# EAGLE design pcbv1schematic (EAGLE 9.6.2)
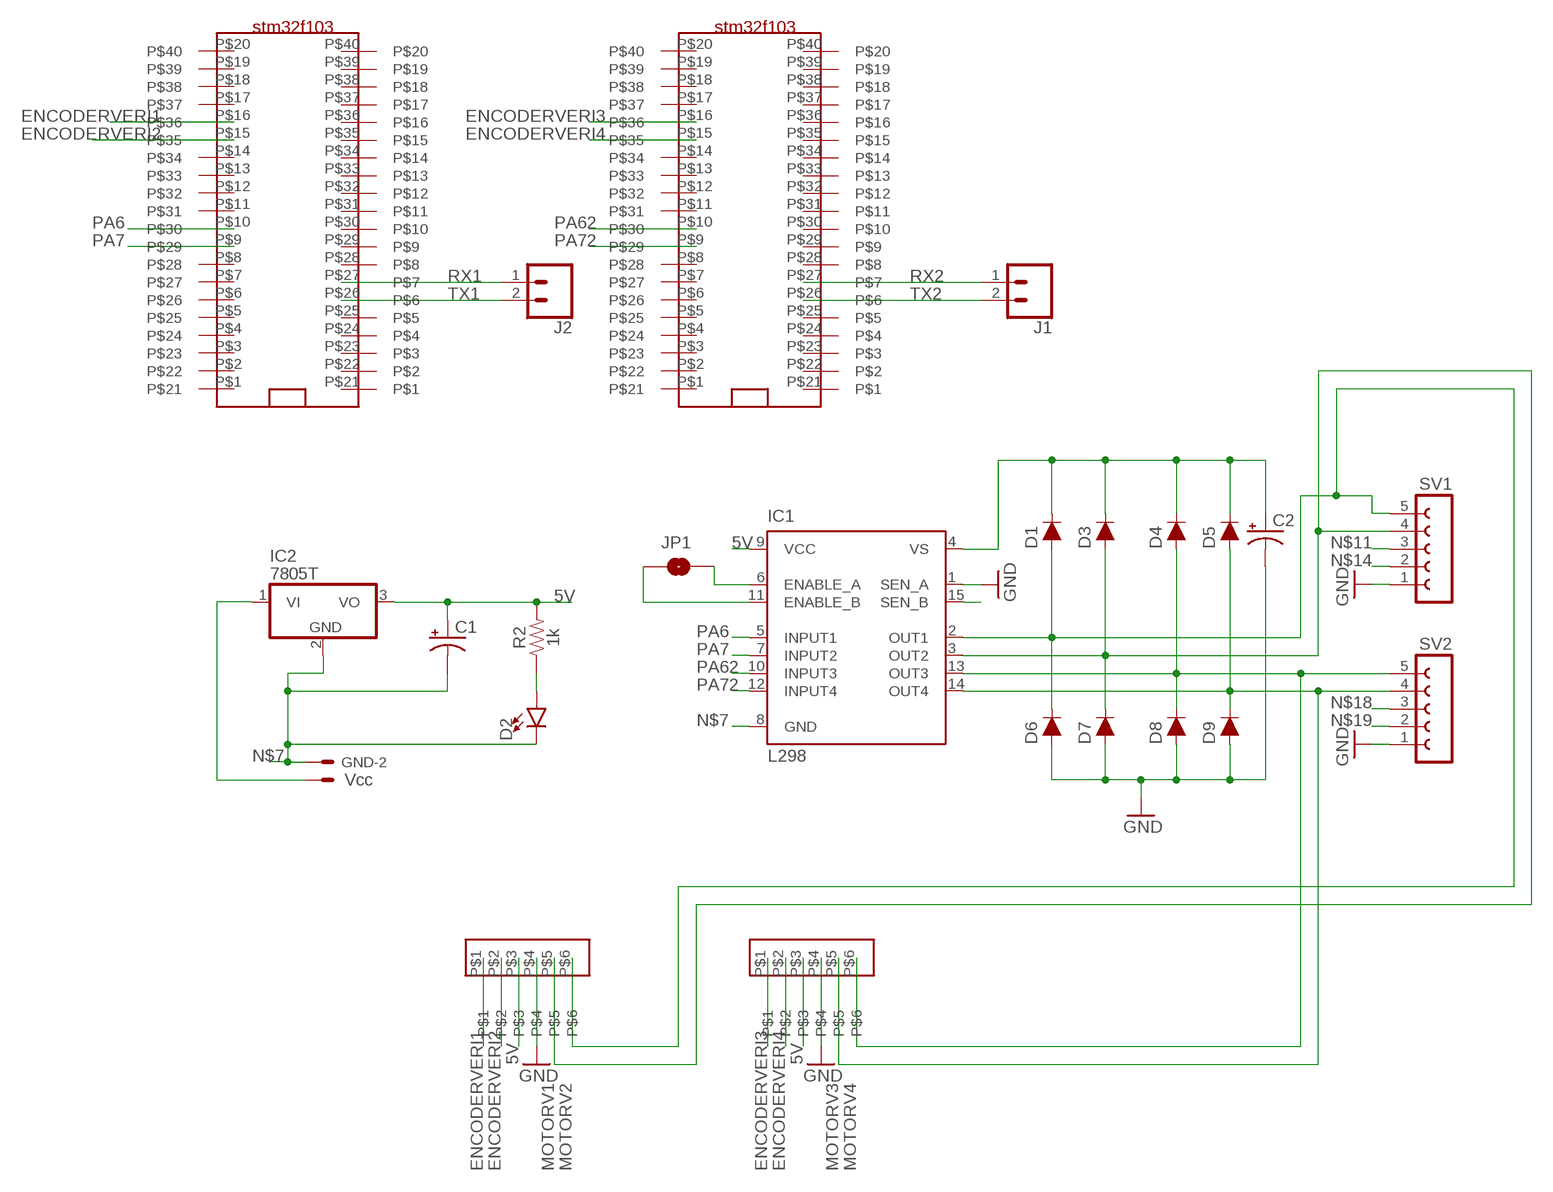
[diagram p0: schematic, sheet 1]

## Parts
C1  1mf  1000UF-RADIAL-5MM-35V-20%-KIT  [CPOL-RADIAL-5MM-10MM-KIT]
C2  1mf  1000UF-RADIAL-5MM-35V-20%-KIT  [CPOL-RADIAL-5MM-10MM-KIT]
D1  200mA/100V/1V  DIODE-1N4148  [DIODE-1N4148]
D2  LED0603  [LED-0603]
D3  200mA/100V/1V  DIODE-1N4148  [DIODE-1N4148]
D4  200mA/100V/1V  DIODE-1N4148  [DIODE-1N4148]
D5  200mA/100V/1V  DIODE-1N4148  [DIODE-1N4148]
D6  200mA/100V/1V  DIODE-1N4148  [DIODE-1N4148]
D7  200mA/100V/1V  DIODE-1N4148  [DIODE-1N4148]
D8  200mA/100V/1V  DIODE-1N4148  [DIODE-1N4148]
D9  200mA/100V/1V  DIODE-1N4148  [DIODE-1N4148]
GND  Vcc  22-23-2021  [22-23-2021]
IC1  L298  [MULTIWATT-15]
IC2  7805T  [TO220H]
J1  CONN_02  [1X02]
J2  CONN_02  [1X02]
JP1  JUMPER-SMT_2_NO_NO-SILK  [SMT-JUMPER_2_NO_NO-SILK]
R2  1k  1KOHM-0603-1/10W-1%  [0603]
SV1  FE05-1  [FE05-1]
SV2  FE05-1  [FE05-1]
U$1  STM32F103  [STM32F103]
U$2  STM32F103  [STM32F103]
U$3  KLAMENS6  [KLAMENS6]
U$4  KLAMENS6  [KLAMENS6]

## Nets
5V: C1.+ IC1.9(VCC) IC2.3(VO) R2.2 U$3.P$3 U$4.P$3
ENCODERVERI1: U$2.P$16 U$3.P$1
ENCODERVERI2: U$2.P$15 U$3.P$2
ENCODERVERI3: U$1.P$16 U$4.P$1
ENCODERVERI4: U$1.P$15 U$4.P$2
MOTORV1: D3.A D7.C IC1.3(OUT2) SV1.4 U$3.P$5
MOTORV2: D1.A D6.C IC1.2(OUT1) SV1.5 U$3.P$6
MOTORV3: D5.A D9.C IC1.14(OUT4) SV2.4 U$4.P$5
MOTORV4: D4.A D8.C IC1.13(OUT3) SV2.5 U$4.P$6
N$1: GND.2 IC2.1(VI)
N$3: IC1.11(ENABLE_B) JP1.1
N$4: D2.A R2.1
N$6: IC1.15(SEN_B)
N$7: C1.- C2.- D2.C D6.A D7.A D8.A D9.A GND.1 IC1.1(SEN_A) IC1.8(GND) IC2.2(GND) SV1.1 SV2.1 U$3.P$4 U$4.P$4 ; supply symbol labelled GND
N$11: SV1.3
N$12: IC1.6(ENABLE_A) JP1.2
N$14: SV1.2
N$18: SV2.3
N$19: SV2.2
OUT1: C2.+ D1.C D3.C D4.C D5.C IC1.4(VS)
PA6: IC1.5(INPUT1) U$2.P$10
PA7: IC1.7(INPUT2) U$2.P$9
PA62: IC1.10(INPUT3) U$1.P$10
PA72: IC1.12(INPUT4) U$1.P$9
RX1: J2.1 U$2.P$27
RX2: J1.1 U$1.P$27
TX1: J2.2 U$2.P$26
TX2: J1.2 U$1.P$26
Unconnected: U$1.P$1 U$1.P$2 U$1.P$3 U$1.P$4 U$1.P$5 U$1.P$6 U$1.P$7 U$1.P$8 U$1.P$11 U$1.P$12 U$1.P$13 U$1.P$14 U$1.P$17 U$1.P$18 U$1.P$19 U$1.P$20 U$1.P$21 U$1.P$22 U$1.P$23 U$1.P$24 U$1.P$25 U$1.P$28 U$1.P$29 U$1.P$30 U$1.P$31 U$1.P$32 U$1.P$33 U$1.P$34 U$1.P$35 U$1.P$36 U$1.P$37 U$1.P$38 U$1.P$39 U$1.P$40 U$2.P$1 U$2.P$2 U$2.P$3 U$2.P$4 U$2.P$5 U$2.P$6 U$2.P$7 U$2.P$8 U$2.P$11 U$2.P$12 U$2.P$13 U$2.P$14 U$2.P$17 U$2.P$18 U$2.P$19 U$2.P$20 U$2.P$21 U$2.P$22 U$2.P$23 U$2.P$24 U$2.P$25 U$2.P$28 U$2.P$29 U$2.P$30 U$2.P$31 U$2.P$32 U$2.P$33 U$2.P$34 U$2.P$35 U$2.P$36 U$2.P$37 U$2.P$38 U$2.P$39 U$2.P$40

## Library data of the parts
C1 C2 = SparkFun-Capacitors:1000UF: 1,000µF/1mF ceramic capacitors A capacitor is a passive two-terminal electrical component used to store electrical energy temporarily in an electric field. CAP-08070; PROD_ID: CAP-09538
D1 D3-D9 = SparkFun-DiscreteSemi:DIODE: Diode These are standard reverse protection diodes and small signal diodes. SparkFun Products: SparkFun SparkPunk Sound Kit <https://www.sparkfun.com/products/11177> SparkFun ESP8266 Thing <https://www.sparkfun.com/products/13231>; PROD_ID: DIO-08378
D2 = SparkFun-LED:LED: LED (Generic) Standard schematic elements and footprints for 5mm, 3mm, 1206, and 0603 sized LEDs. Generic LEDs with no color specified.
GND = con-molex:22-23-2021: .100" (2.54mm) Center Header - 2 Pin; MF: MOLEX; MPN: 22-23-2021; OC_FARNELL: 1462926; OC_NEWARK: 25C3832
IC1 = st-microelectronics:L298: DUAL FULL-BRIDGE DRIVER; MPN: L298N; OC_FARNELL: 1589425; OC_NEWARK: 32M1527
IC2 = linear:78*: Positive VOLTAGE REGULATOR Source: http://cache.national.com/ds/LM/LM78L05.pdf http://www.fairchildsemi.com/ds/LM/LM7805.pdf
J1 J2 = SparkFun-Connectors:CONN_02: Multi connection point. Often used as Generic Header-pin footprint for 0.1 inch spaced/style header connections On any of the 0.1 inch spaced packages, you can populate with these: Break Away Headers - Straight <https://www.sparkfun.com/products/116> (PRT-00116) Break Away Male Headers - Right Angle <https://www.sparkfun.com/products/553> (PRT-00553) Female Headers <https://www.sparkfun.com/products/115> (PRT-00115) Break Away Headers - Machine Pin <https://www.sparkfun.com/products/117> (PRT-00117) Break Away Female Headers - Swiss Machine Pin <https://www.sparkfun.com/products/743> (PRT-00743) For SCREWTERMINALS and SPRING TERMINALS visit here: Screw Terimnals on SparkFun.com <https://www.sparkfun.com/search/results?term=Screw+Terminals> (5mm/3.5mm/2.54mm spacing) This device is also useful as a general connection point to wire up your design to another part of your project. Our various solder wires solder well into these plated through hole pads. Hook-Up Wire - Assortment (Stranded, 22 AWG) <https://www.sparkfun.com/products/11375> (PRT-11375) Hook-Up Wire - Assortment (Solid Core, 22 AWG) <https://www.sparkfun.com/products/11367> (PRT-11367) View the entire wire category on our website here <https://www.sparkfun.com/categories/141> Special notes: Molex polarized connector foot print use with: PRT-08233 with associated crimp pins and housings. 2.54_SCREWTERM for use with PRT-10571. 3.5mm Screw Terminal footprints for PRT-08084 5mm Screw Terminal footprints for use with PRT-08432
JP1 = SparkFun-Jumpers:JUMPER-SMT_2_NO: Normally open jumper This jumper has two pads in close proximity to each other. Apply solder to close the connection. Round pads are easier to solder for beginners, but are a lot larger. SparkFun Product that uses the round pads: SparkFun EL Sequencer <https://www.sparkfun.com/products/12781>
R2 = SparkFun-Resistors:1KOHM: 1kΩ resistor A resistor is a passive two-terminal electrical component that implements electrical resistance as a circuit element. Resistors act to reduce current flow, and, at the same time, act to lower voltage levels within circuits. - Wikipedia; PROD_ID: RES-07856
SV1 SV2 = con-lsta:FE05-1: FEMALE HEADER; OC_FARNELL: unknown; OC_NEWARK: unknown
U$1 U$2 = pcbv1:STM32F103
U$3 U$4 = klamens6x:KLAMENS6

## Board
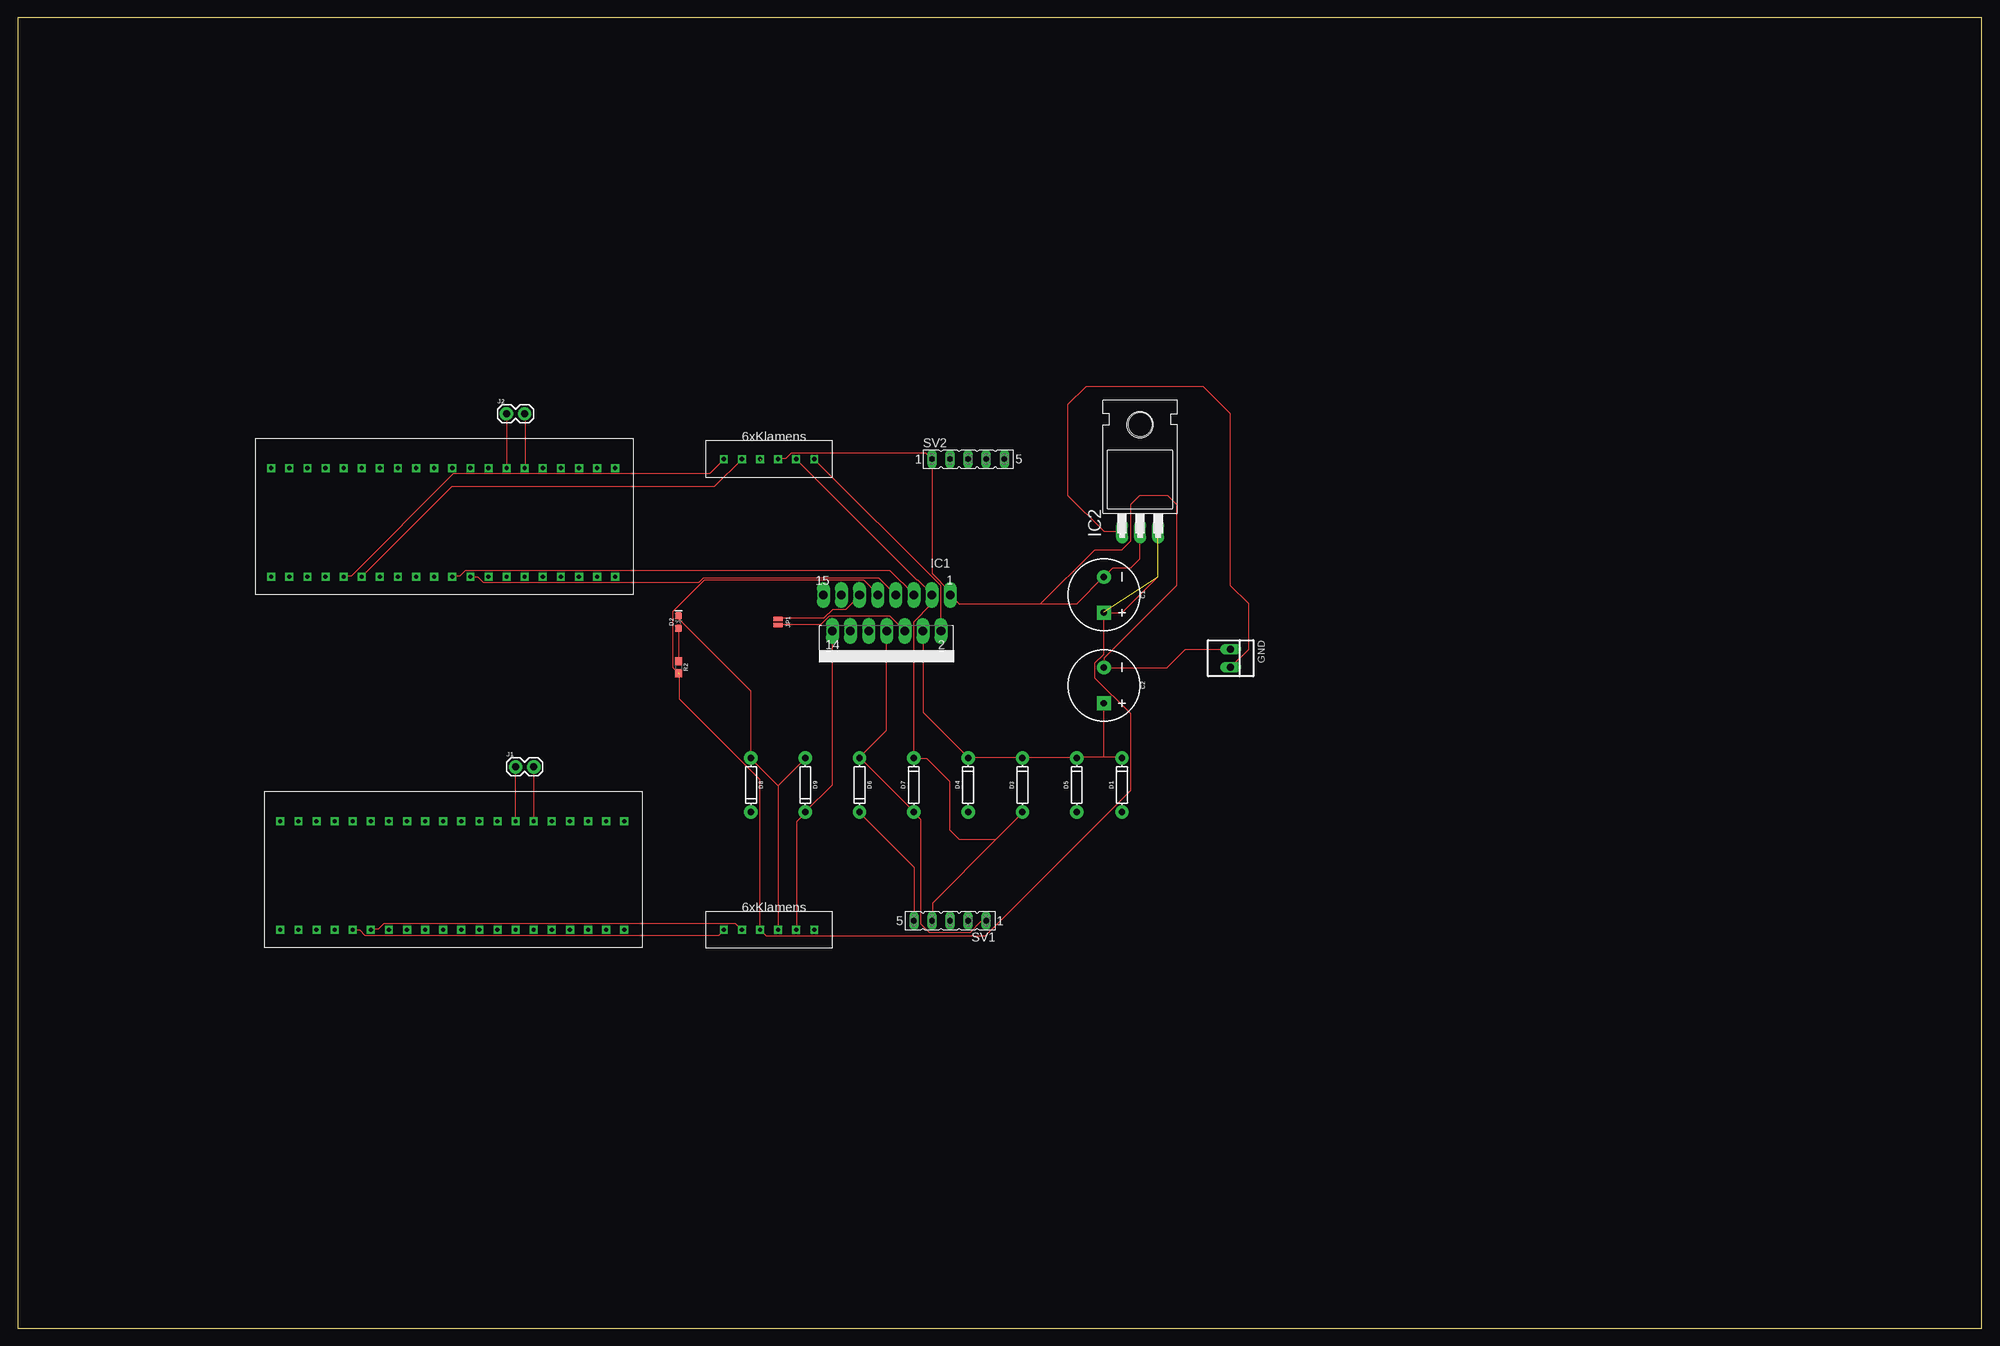
[diagram p1: board, top side]
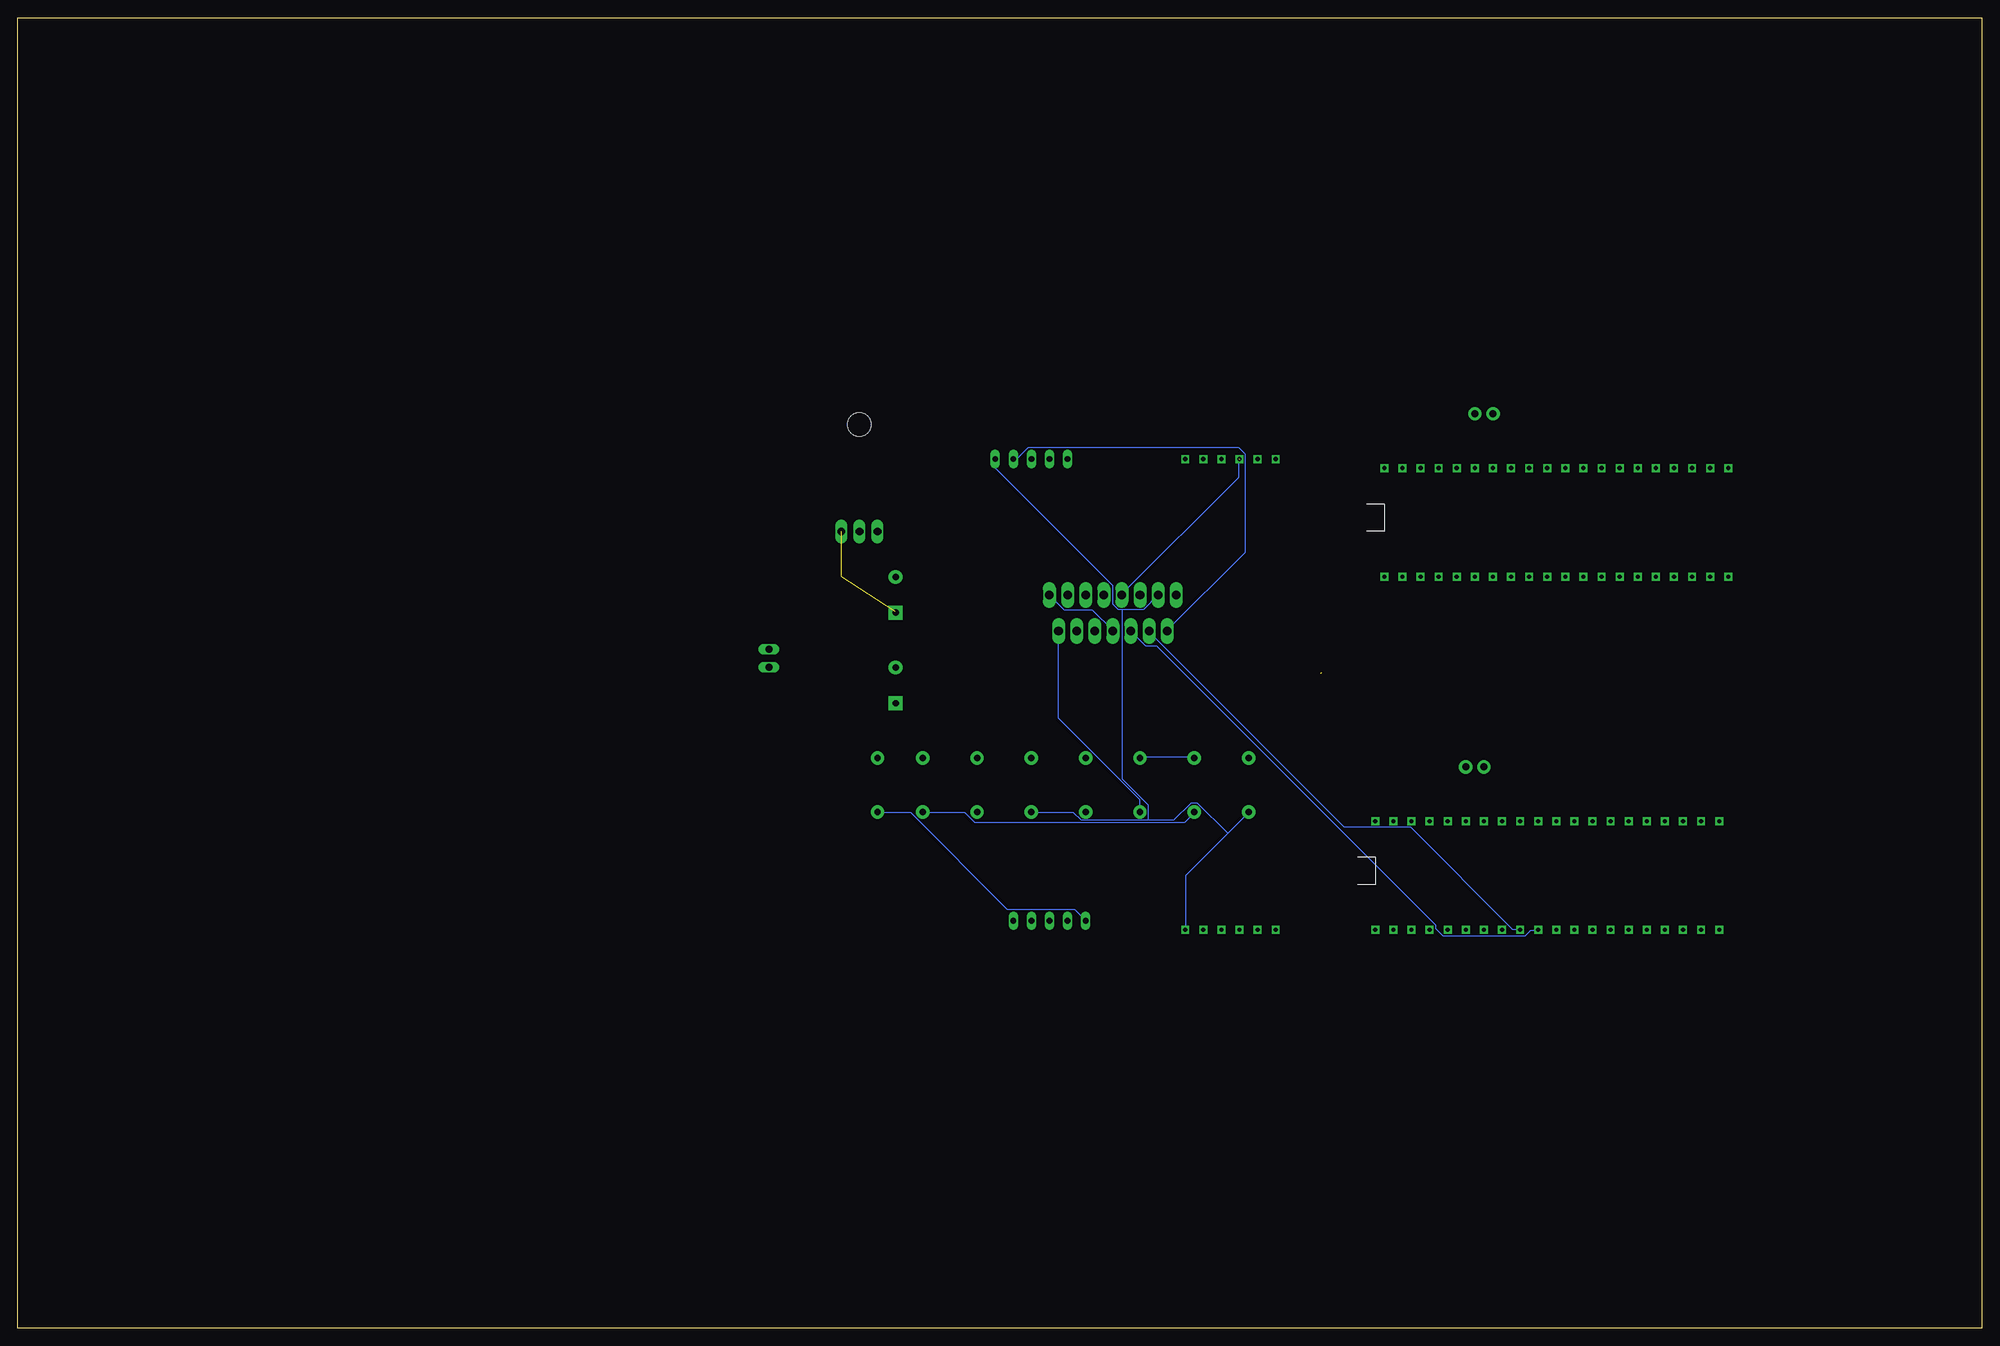
[diagram p2: board, bottom side, seen from below]

Size 275.57 x 183.82 mm. Coordinates in mm from the lower left corner, seen from the top.
Outline: 0,0 275.57,0 275.57,183.82 0,183.82 0,0
Copper layers (1*16): Top 0.035mm / dielectric 1.5mm / Bottom 0.035mm
Design rules "default": minimum track width 6mil, minimum drill 0.35mm, track to track 6mil, track to pad 6mil, pad to pad 6mil, via to via 6mil, smd to smd 6mil, copper to edge 40mil, drill to drill 6mil, minimum pad ring 10mil, minimum via ring 8mil, stop-mask expansion 4mil, vias tented up to drill 0mil, thermal gap 10mil

### Footprints (pad centres in the part's own frame; a part is rotated, then mirrored left to right if it is on the bottom)
CPOL-RADIAL-5MM-10MM-KIT = drill 0.9 pad 1.93 square: + 2.5,0 | drill 0.9 pad 1.93: - -2.5,0
DIODE-1N4148 = drill 0.9 pad 1.88: A -3.81,0; C 3.81,0
LED-0603 = smd 1 x 1: A -0.877,0; C 0.877,0
22-23-2021 = drill 1 long: 1 -1.27,0; 2 1.27,0
MULTIWATT-15 = drill 1.2 long: 1 -8.89,-7.62; 2 -7.62,-2.54; 3 -6.35,-7.62; 4 -5.08,-2.54; 5 -3.81,-7.62; 6 -2.54,-2.54; 7 -1.27,-7.62; 8 0,-2.54; 9 1.27,-7.62; 10 2.54,-2.54; 11 3.81,-7.62; 12 5.08,-2.54; 13 6.35,-7.62; 14 7.62,-2.54; 15 8.89,-7.62
TO220H = drill 1.118 long: 1 -2.54,-10.16; 2 0,-10.16; 3 2.54,-10.16 | hole 3.302: 0,4.826
1X02 = drill 1.016 pad 1.88: 1 0,0; 2 2.54,0
SMT-JUMPER_2_NO_NO-SILK = smd 0.635 x 1.27: 1 -0.406,0; 2 0.406,0
0603 = smd 1.1 x 1: 1 -0.85,0; 2 0.85,0
FE05-1 = drill 0.813 long: 1 -5.08,0; 2 -2.54,0; 3 0,0; 4 2.54,0; 5 5.08,0
STM32F103 = drill 0.6 square: P$1 2.54,2.54; P$2 2.54,5.08; P$3 2.54,7.62; P$4 2.54,10.16; P$5 2.54,12.7; P$6 2.54,15.24; P$7 2.54,17.78; P$8 2.54,20.32; P$9 2.54,22.86; P$10 2.54,25.4; P$11 2.54,27.94; P$12 2.54,30.48; P$13 2.54,33.02; P$14 2.54,35.56; P$15 2.54,38.1; P$16 2.54,40.64; P$17 2.54,43.18; P$18 2.54,45.72; P$19 2.54,48.26; P$20 2.54,50.8; P$21 17.78,2.54; P$22 17.78,5.08; P$23 17.78,7.62; P$24 17.78,10.16; P$25 17.78,12.7; P$26 17.78,15.24; P$27 17.78,17.78; P$28 17.78,20.32; P$29 17.78,22.86; P$30 17.78,25.4; P$31 17.78,27.94; P$32 17.78,30.48; P$33 17.78,33.02; P$34 17.78,35.56; P$35 17.78,38.1; P$36 17.78,40.64; P$37 17.78,43.18; P$38 17.78,45.72; P$39 17.78,48.26; P$40 17.78,50.8
KLAMENS6 = drill 0.6 square: P$1 -10.16,2.54; P$2 -7.62,2.54; P$3 -5.08,2.54; P$4 -2.54,2.54; P$5 0,2.54; P$6 2.54,2.54

### Placement (x,y rotation side)
C1  152.4,102.87 270 top
C2  152.4,90.17 270 top
D1  154.94,76.2 90 top
D2  92.71,99.06 90 top
D3  140.97,76.2 90 top
D4  133.35,76.2 90 top
D5  148.59,76.2 90 top
D6  118.11,76.2 270 top
D7  125.73,76.2 90 top
D8  102.87,76.2 270 top
D9  110.49,76.2 270 top
GND  170.18,93.98 270 top
IC1  121.92,95.25 180 top
IC2  157.48,121.92 0 top
J1  69.85,78.74 0 top
J2  68.58,128.27 0 top
JP1  106.68,99.06 270 top
R2  92.71,92.71 270 top
SV1  130.81,57.15 180 top
SV2  133.35,121.92 0 top
U$1  87.63,53.34 90 top
U$2  86.36,102.87 90 top
U$3  109.22,119.38 0 top
U$4  109.22,53.34 0 top

### Tracks (layer width: path | path; a pad name or v marks a point on that pad's centre or on a via)
5V  (5 unrouted)
  Top 0.152: 92.66,91.95 91.9,92.71 91.9,100.48 96.32,104.9 118.72,104.9 120.7,102.92 IC1.9 120.7,102.77 | 160.02,105.41 154.94,100.33 152.4,100.33 152.4,94.54 151.18,93.32 151.18,91.19 156.21,86.16 156.21,75.49 135.79,55.07 105,55.07 104.24,55.83 U$4.P$3 104.09,55.98 104.09,77.01 92.81,88.29 92.81,91.8
  Bottom 0.152: 152.4,100.48 C1.+ 152.4,100.33 | 104.24,121.82 104.24,119.38 120.7,102.92 IC1.9
ENCODERVERI1
  Top 0.152: U$2.P$16 45.72,105.51 46.79,105.51 61.11,119.84 97.08,119.84 99.06,121.82 U$3.P$1
ENCODERVERI2
  Top 0.152: U$2.P$15 60.96,118.11 97.79,118.11 U$3.P$2
ENCODERVERI3
  Top 0.152: U$1.P$16 47.09,55.83 48.01,55.83 48.77,55.07 98.3,55.07 99.06,55.83 U$4.P$1
ENCODERVERI4
  Top 0.152: U$4.P$2 100.74,56.74 51.36,56.74 50.6,55.98 49.53,55.98 U$1.P$15
MOTORV1
  Top 0.152: U$3.P$5 109.27,121.82 126.19,104.9 126.34,104.9 128.32,102.92 IC1.3 128.17,102.77 128.17,101.55 125.73,99.11 D7.C 125.73,79.91 127.56,79.91 130.81,76.66 130.81,69.85 132.13,68.53 137.21,68.53 | 137.21,68.53 140.97,72.29 D3.A | 137.21,68.53 128.32,59.64 128.32,57.2 SV1.4
MOTORV2
  Top 0.152: U$3.P$6 129.54,104.14 IC1.2 | SV1.5 125.73,64.67 118.11,72.29 D6.C
  Bottom 0.152: D1.A 154.84,72.29 150.27,72.29 136.7,58.72 127.25,58.72 125.73,57.2 SV1.5 | IC1.2 129.54,85.55 118.11,74.12 D6.C
MOTORV3
  Top 0.152: U$4.P$5 109.27,55.98 109.27,71.07 110.49,72.29 D9.C 110.49,72.44 114.3,76.25 IC1.14
  Bottom 0.152: SV2.4 135.79,121.97 135.33,121.97 133.81,123.5 104.24,123.5 103.33,122.58 103.33,108.86 114.3,97.89 IC1.14 | D5.A 148.59,72.29 142.65,72.29 141.28,70.92 111.86,70.92 110.49,72.29 D9.C
MOTORV4
  Bottom 0.152: 120.55,100.79 117.65,100.79 IC1.13 | 120.55,100.79 121.16,100.79 121.92,101.55 121.92,104.14 138.38,120.6 138.38,121.82 SV2.5 | 105.77,69.39 102.87,72.29 D8.C | 105.77,69.39 111.71,63.45 111.71,55.98 U$4.P$6 | 116.89,71.22 113.39,71.22 110.95,73.66 110.03,73.66 105.77,69.39 | 116.89,71.22 126.34,71.22 127.41,72.29 133.35,72.29 D4.A | 120.55,100.79 120.55,77.01 116.89,73.35 116.89,71.22
N$1
  Top 0.152: GND.2 172.72,95.25 172.72,101.6 170.18,104.14 170.18,128.27 166.37,132.08 149.86,132.08 147.32,129.54 147.32,116.84 152.4,111.76 IC2.1
N$3
  Top 0.152: JP1.1 106.68,99.57 113.08,99.57 114.3,100.79 116.13,100.79 118.11,102.77 IC1.11
N$4
  Top 0.152: D2.A 92.81,98.04 92.81,93.62 R2.1
N$7
  Top 0.152: 143.51,101.6 151.13,109.22 154.94,109.22 156.21,110.49 156.21,115.57 157.48,116.84 161.29,116.84 162.56,115.57 162.56,104.14 152.4,93.98 C2.- 161.25,92.67 163.83,95.25 GND.1 | SV1.1 135.79,57.05 135.18,57.05 133.66,55.52 127.86,55.52 126.64,56.74 126.64,71.37 125.73,72.29 D7.A 125.73,72.44 118.11,80.06 | U$3.P$4 106.68,121.97 107.75,121.97 108.51,122.73 127.41,122.73 128.17,121.97 SV2.1 128.32,121.82 128.32,105.82 130.76,103.38 130.76,102.92 IC1.1 132.08,101.6 | D2.C 92.81,99.87 92.81,99.42 102.87,89.36 D8.A 102.87,79.91 106.68,76.1 | 106.68,76.1 U$4.P$4 | 106.68,76.1 110.49,79.91 D9.A | IC1.8 121.92,83.87 118.11,80.06 | 118.11,80.06 D6.A | 132.08,101.6 132.13,101.55 | IC2.2 157.48,107.95 156.21,106.68 153.67,106.68 152.38,105.38 | 132.08,101.6 143.51,101.6 | 143.51,101.6 143.56,101.6 | 143.56,101.6 148.59,101.6 152.38,105.38 | C1.- 152.38,105.38 | 143.56,101.6 143.56,101.55 143.51,101.6
  Bottom 0.152: 157.43,111.76 IC2.2 | 152.4,92.71 C2.- | IC1.8 121.92,97.89 124.82,100.79 128.78,100.79 130.76,102.77 IC1.1 | D6.A 118.11,80.06 110.49,80.06 D9.A
N$12
  Top 0.152: JP1.2 112.62,98.65 113.84,99.87 122.38,99.87 IC1.6
OUT1
  Top 0.152: 152.4,80.06 154.84,80.06 D1.C | 152.4,80.06 148.59,80.06 | 152.4,80.06 C2.+ | 133.35,80.06 127.1,86.31 127.1,97.74 IC1.4 | 133.35,80.06 140.97,80.06 | 133.35,80.06 D4.C | 140.97,80.06 148.59,80.06 | 148.59,80.06 D5.C | 140.97,80.06 D3.C
PA6
  Top 0.152: U$2.P$10 60.96,105.51 62.03,105.51 62.79,106.27 122.38,106.27 125.73,102.92 IC1.5
PA7
  Top 0.152: IC1.7 120.85,105.21 96.16,105.21 95.56,104.6 65.38,104.6 64.62,105.36 63.55,105.36 U$2.P$9
PA62
  Bottom 0.152: IC1.10 117.35,95.76 115.82,95.76 76.66,56.59 76.66,56.13 75.59,55.07 64.01,55.07 63.25,55.83 62.33,55.83 U$1.P$10
PA72
  Bottom 0.152: U$1.P$9 64.77,55.98 65.84,55.98 80.16,70.31 89.46,70.31 116.89,97.74 IC1.12
RX1
  Top 0.152: J2.1 U$2.P$27
RX2
  Top 0.152: U$1.P$27 69.8,71.22 69.8,78.69 J1.1
TX1
  Top 0.152: U$2.P$26 71.17,120.75 71.17,128.22 J2.2
TX2
  Top 0.152: J1.2 U$1.P$26